# Altium schematic sheet KL25Z_CAN_Interface.SchDoc: KL25Z - CAN Interface
size A3; DrawnBy: Fabian Niederberger; Engineer: Fabian Niederberger; Organization: HSLU T&A; Address1: Abteilung Elektrotechnik; Address2: Technikumsstrasse 21; Address3: CH-6048 Horw; Revision: V1.0; SheetNumber: 1; SheetTotal: 1; Projektname: E-Rollator Remote; pcbDesigner: Fabian Niederberger; DocumentName: KL25Z - CAN Interface; ProjectName: E-Rollator Remote
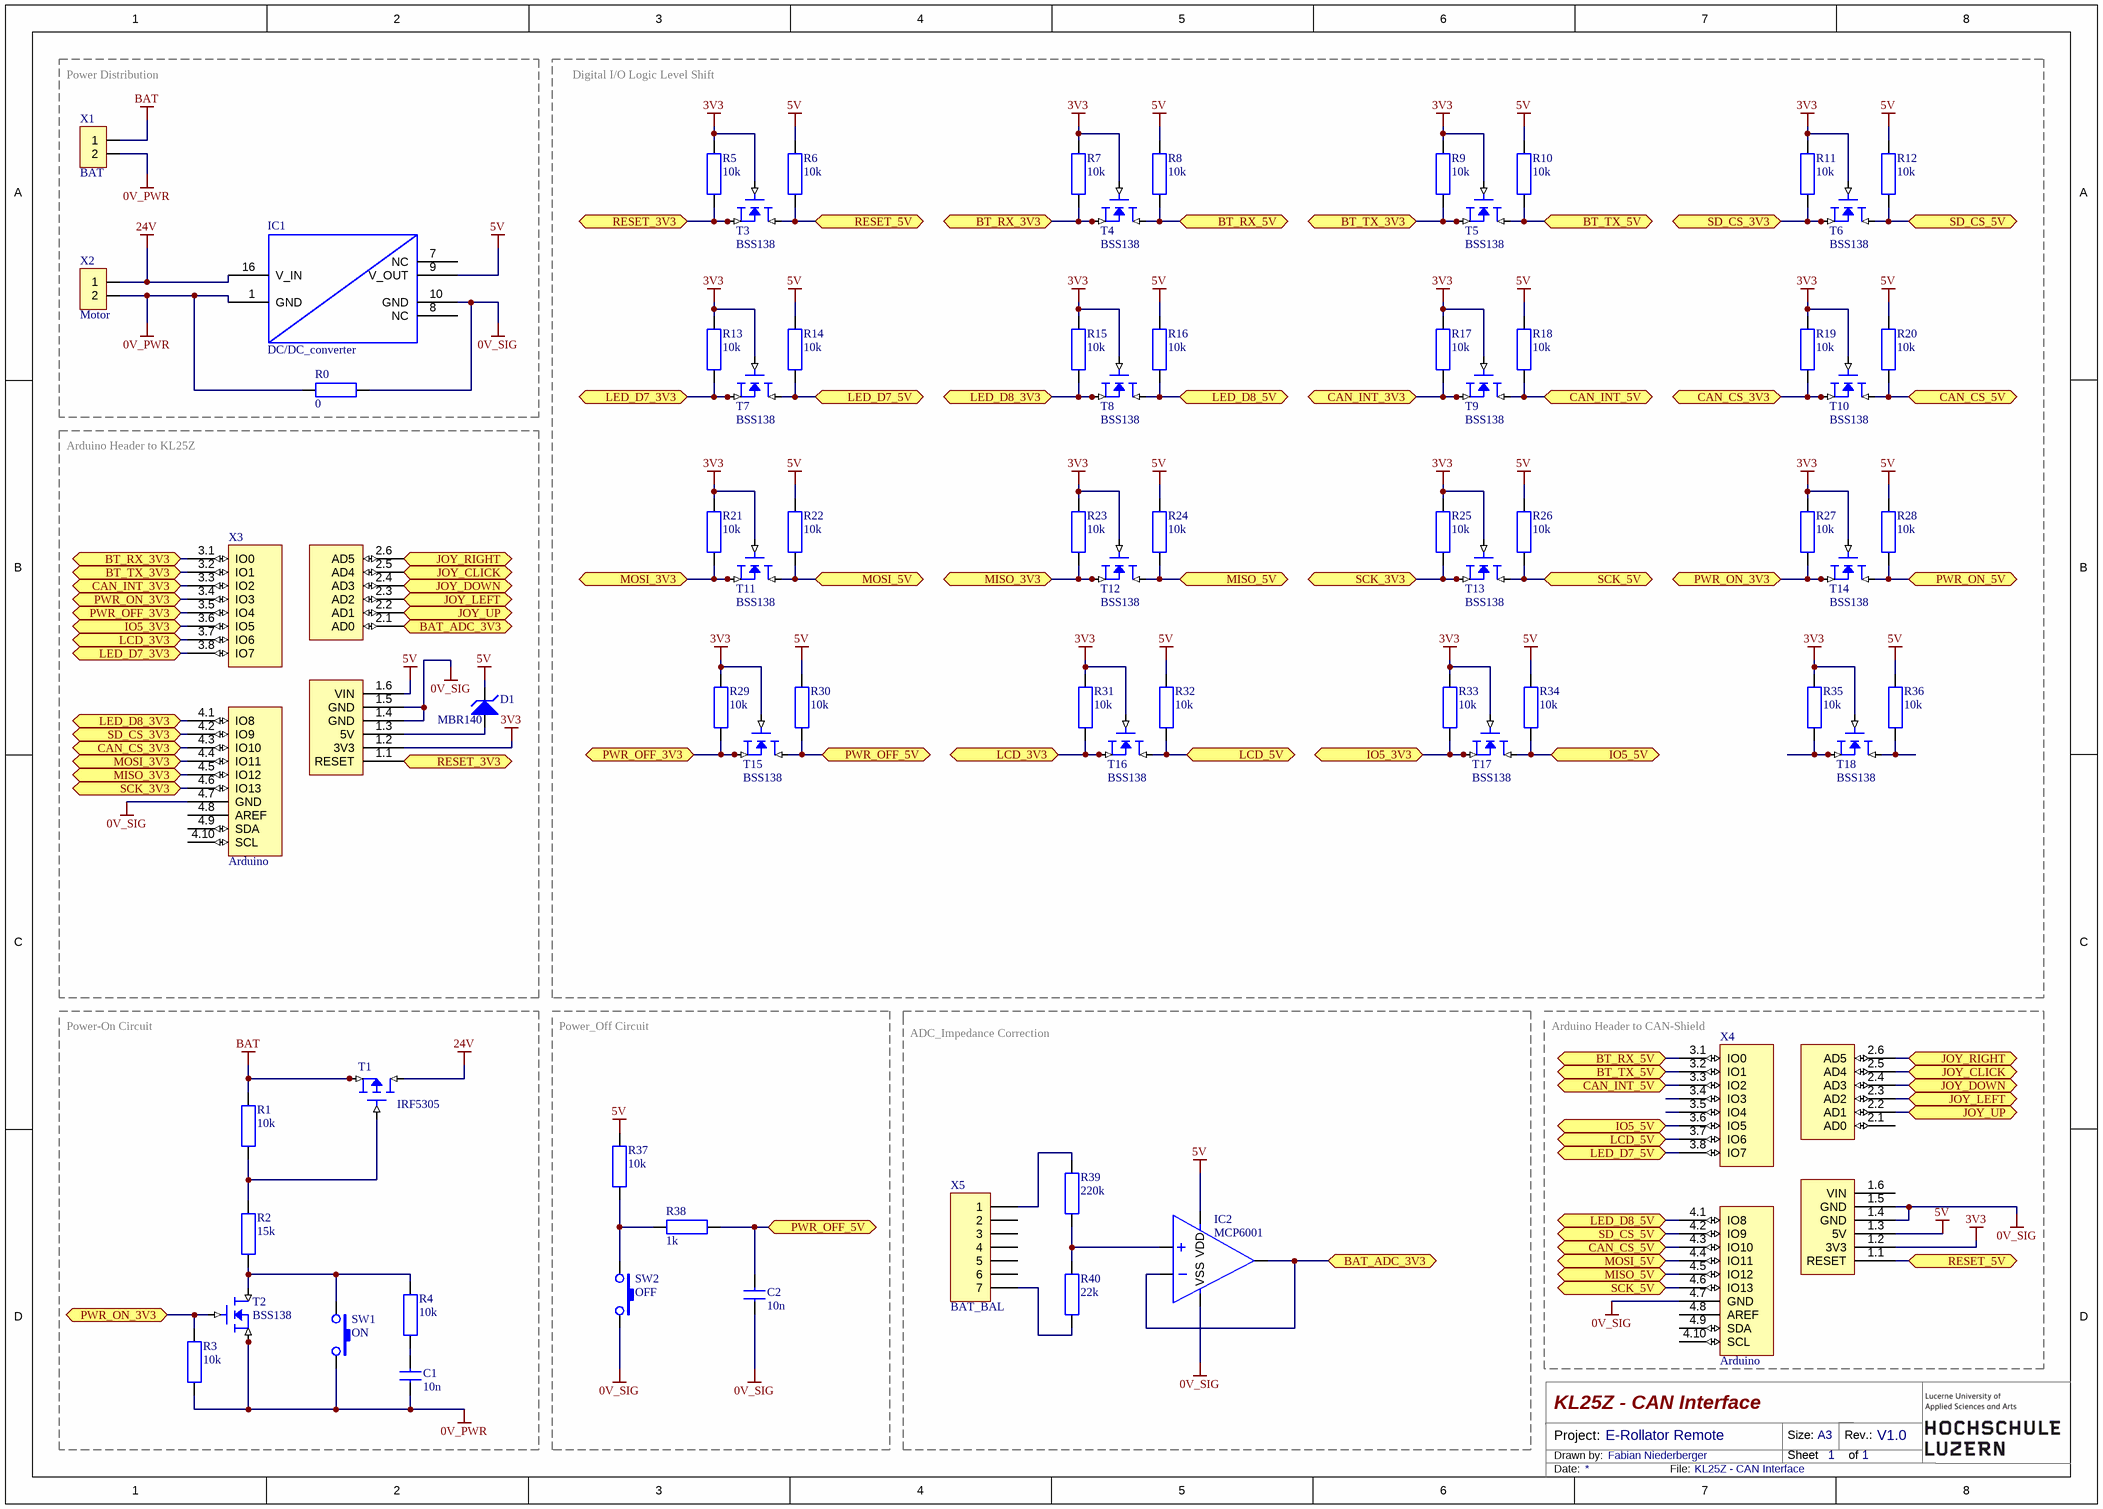
[diagram p0: KL25Z_CAN_Interface.SchDoc]

## Parts
C1  10n  [0603]
C2  10n  [0603]
D1  MBR140  [SOD-123FL]
IC1  DC/DC_converter  [DC/DC_Conv]
IC2  MCP6001  [SOT-23-5]
R0  0  [0603]
R1  10k  [0603]
R2  15k  [0603]
R3  10k  [0603]
R4  10k  [0603]
R5  10k  [0603]
R6  10k  [0603]
R7  10k  [0603]
R8  10k  [0603]
R9  10k  [0603]
R10  10k  [0603]
R11  10k  [0603]
R12  10k  [0603]
R13  10k  [0603]
R14  10k  [0603]
R15  10k  [0603]
R16  10k  [0603]
R17  10k  [0603]
R18  10k  [0603]
R19  10k  [0603]
R20  10k  [0603]
R21  10k  [0603]
R22  10k  [0603]
R23  10k  [0603]
R24  10k  [0603]
R25  10k  [0603]
R26  10k  [0603]
R27  10k  [0603]
R28  10k  [0603]
R29  10k  [0603]
R30  10k  [0603]
R31  10k  [0603]
R32  10k  [0603]
R33  10k  [0603]
R34  10k  [0603]
R35  10k  [0603]
R36  10k  [0603]
R37  10k  [0603]
R38  1k  [0603]
R39  220k  [0603]
R40  22k  [0603]
SW1  ON  [TASTER_B3FS]
SW2  OFF  [TASTER_B3FS]
T1  IRF5305  [D2PAK_M]
T2  BSS138  [SOT-23]
T3  BSS138  [SOT-23]
T4  BSS138  [SOT-23]
T5  BSS138  [SOT-23]
T6  BSS138  [SOT-23]
T7  BSS138  [SOT-23]
T8  BSS138  [SOT-23]
T9  BSS138  [SOT-23]
T10  BSS138  [SOT-23]
T11  BSS138  [SOT-23]
T12  BSS138  [SOT-23]
T13  BSS138  [SOT-23]
T14  BSS138  [SOT-23]
T15  BSS138  [SOT-23]
T16  BSS138  [SOT-23]
T17  BSS138  [SOT-23]
T18  BSS138  [SOT-23]
X1  BAT  [BAT_EC5/XT90_90]
X2  Motor  [POWER_WAGO_2]
X3  Arduino  [Arduino_Header]
X4  Arduino  [Arduino_Header]
X5  BAT_BAL  [68800711722]

## Ports
BAT_ADC_3V3, BT_RX_3V3, BT_RX_5V, BT_TX_3V3, BT_TX_5V, CAN_CS_3V3, CAN_CS_5V, CAN_INT_3V3, CAN_INT_5V, IO5_3V3, IO5_5V, JOY_CLICK, JOY_DOWN, JOY_LEFT, JOY_RIGHT, JOY_UP, LCD_3V3, LCD_5V, LED_D7_3V3, LED_D7_5V, LED_D8_3V3, LED_D8_5V, MISO_3V3, MISO_5V, MOSI_3V3, MOSI_5V, PWR_OFF_3V3, PWR_OFF_5V, PWR_ON_3V3, PWR_ON_5V, RESET_3V3, RESET_5V, SCK_3V3, SCK_5V, SD_CS_3V3, SD_CS_5V

## Nets
0V_PWR: C1.2 IC1.1(GND) R0.2 R3.1 SW1.2 T2.3 T2.4 X1.2 X2.2
0V_SIG: C2.2 IC1.10(GND) IC2.2(VSS) R0.1 SW2.2 X3.1.4(GND) X3.1.5(GND) X3.4.7(GND) X4.1.4(GND) X4.1.5(GND) X4.4.7(GND)
3V3: R5.2 R7.2 R9.2 R11.2 R13.2 R15.2 R17.2 R19.2 R21.2 R23.2 R25.2 R27.2 R29.2 R31.2 R33.2 R35.2 T3.2 T4.2 T5.2 T6.2 T7.2 T8.2 T9.2 T10.2 T11.2 T12.2 T13.2 T14.2 T15.2 T16.2 T17.2 T18.2 X3.1.2(3V3) X4.1.2(3V3)
5V: D1.K IC1.9(V_OUT) IC2.5(VDD) R6.2 R8.2 R10.2 R12.2 R14.2 R16.2 R18.2 R20.2 R22.2 R24.2 R26.2 R28.2 R30.2 R32.2 R34.2 R36.2 R37.2 X3.1.6(VIN) X4.1.3(5V)
24V: IC1.16(V_IN) T1.1 X2.1
BAT: R1.2 T1.3 T1.4 X1.1
BAT_ADC_3V3: IC2.1 IC2.4 X3.2.1(AD0) ; port BAT_ADC_3V3
BT_RX_3V3: R7.1 T4.3 T4.4 X3.3.1(IO0) ; port BT_RX_3V3
BT_RX_5V: R8.1 T4.1 X4.3.1(IO0) ; port BT_RX_5V
BT_TX_3V3: R9.1 T5.3 T5.4 X3.3.2(IO1) ; port BT_TX_3V3
BT_TX_5V: R10.1 T5.1 X4.3.2(IO1) ; port BT_TX_5V
CAN_CS_3V3: R19.1 T10.3 T10.4 X3.4.3(IO10) ; port CAN_CS_3V3
CAN_CS_5V: R20.1 T10.1 X4.4.3(IO10) ; port CAN_CS_5V
CAN_INT_3V3: R17.1 T9.3 T9.4 X3.3.3(IO2) ; port CAN_INT_3V3
CAN_INT_5V: R18.1 T9.1 X4.3.3(IO2) ; port CAN_INT_5V
IO5_3V3: R33.1 T17.3 T17.4 X3.3.6(IO5) ; port IO5_3V3
IO5_5V: R34.1 T17.1 X4.3.6(IO5) ; port IO5_5V
JOY_CLICK: X3.2.5(AD4) X4.2.5(AD4) ; port JOY_CLICK
JOY_DOWN: X3.2.4(AD3) X4.2.4(AD3) ; port JOY_DOWN
JOY_LEFT: X3.2.3(AD2) X4.2.3(AD2) ; port JOY_LEFT
JOY_RIGHT: X3.2.6(AD5) X4.2.6(AD5) ; port JOY_RIGHT
JOY_UP: X3.2.2(AD1) X4.2.2(AD1) ; port JOY_UP
LCD_3V3: R31.1 T16.3 T16.4 X3.3.7(IO6) ; port LCD_3V3
LCD_5V: R32.1 T16.1 X4.3.7(IO6) ; port LCD_5V
LED_D7_3V3: R13.1 T7.3 T7.4 X3.3.8(IO7) ; port LED_D7_3V3
LED_D7_5V: R14.1 T7.1 X4.3.8(IO7) ; port LED_D7_5V
LED_D8_3V3: R15.1 T8.3 T8.4 X3.4.1(IO8) ; port LED_D8_3V3
LED_D8_5V: R16.1 T8.1 X4.4.1(IO8) ; port LED_D8_5V
MISO_3V3: R23.1 T12.3 T12.4 X3.4.5(IO12) ; port MISO_3V3
MISO_5V: R24.1 T12.1 X4.4.5(IO12) ; port MISO_5V
MOSI_3V3: R21.1 T11.3 T11.4 X3.4.4(IO11) ; port MOSI_3V3
MOSI_5V: R22.1 T11.1 X4.4.4(IO11) ; port MOSI_5V
PWR_OFF_3V3: R29.1 T15.3 T15.4 X3.3.5(IO4) ; port PWR_OFF_3V3
PWR_OFF_5V: C2.1 R30.1 R38.1 T15.1 ; port PWR_OFF_5V
PWR_ON_3V3: R3.2 R27.1 T2.2 T14.3 T14.4 X3.3.4(IO3) ; port PWR_ON_3V3
PWR_ON_5V: R28.1 T14.1 ; port PWR_ON_5V
RESET_3V3: R5.1 T3.3 T3.4 X3.1.1(RESET) ; port RESET_3V3
RESET_5V: R6.1 T3.1 X4.1.1(RESET) ; port RESET_5V
SCK_3V3: R25.1 T13.3 T13.4 X3.4.6(IO13) ; port SCK_3V3
SCK_5V: R26.1 T13.1 X4.4.6(IO13) ; port SCK_5V
SD_CS_3V3: R11.1 T6.3 T6.4 X3.4.2(IO9) ; port SD_CS_3V3
SD_CS_5V: R12.1 T6.1 X4.4.2(IO9) ; port SD_CS_5V
NetC1_1: C1.1 R4.1
NetD1_A: D1.A X3.1.3(5V)
NetIC2_3: IC2.3 R39.1 R40.2
NetR1_1: R1.1 R2.2 T1.2
NetR2_1: R2.1 R4.2 SW1.1 T2.1
NetR35_1: R35.1 T18.3 T18.4
NetR36_1: R36.1 T18.1
NetR37_1: R37.1 R38.2 SW2.1
NetR39_2: R39.2 X5.1
NetR40_1: R40.1 X5.7

Not connected (* = marked no-connect by the designer): IC1 7(NC) 8(NC); X3 4.8(AREF) 4.9(SDA) 4.10(SCL); X4 1.6(VIN) 2.1(AD0) 3.4(IO3) 3.5(IO4) 4.8(AREF) 4.9(SDA) 4.10(SCL); X5 2 3 4 5 6

## Notes on the sheet
- Power Distribution
- Digital I/O Logic Level Shift
- Arduino Header to KL25Z
  $Power Distribution
- Power-On Circuit
- Power_Off Circuit
- ADC_Impedance Correction
- (near X4) Arduino Header to CAN-Shield
- Project:
- Drawn by:
- Size:
- Sheet
- A3
- Rev.:
- of
- Date:
- File:

## Library data of the parts
C1 C2 = C?: Normaler Kondensator
D1 = D? ZENER: Shottky-Diode
IC1 = DC/DC_converter: DC/DC Converter
R0-R40 = R?: Normaler Widerstand
SW1 SW2 = SW-PB
T1 = M? MOSFET-P: P-channel mosfet; pin to pad: 1>2 2>1 4>3; L: *; W: *; AD: *; AS: *; PD: *; PS: *; NRD: *; NRS: *; NRG: *; NRB: *; M: *
T2-T18 = M? MOSFET-N: N-channel mosfet; pin to pad: 1>3 2>1 3>2 4>2; L: *; W: *; AD: *; AS: *; PD: *; PS: *; NRD: *; NRS: *; NRG: *; NRB: *; M: *
X1 X2 = CON2
X3 X4 = Arduino_Header
X5 = WE-2.50 mm Pitch J Serie 68800711722: WR-WTB 2.50mm Male Shrouded Header J type; Manufacturer: W¨¹rth Elektronik eiSos GmbH; ComponentLink1 Description: Manufacturer; ComponentLink2 Description: Datasheet; NoPins: 7; Created Date: 21 May 2013; partNo: 68800711722; ComponentLink1URL: http://www.we-online.com; ComponentLink2URL: http://katalog.we-online.de/em/datasheet/6880xx11722.pdf; Created by: Karrer Zheng